# EAGLE design Version_1 (EAGLE 6.3)
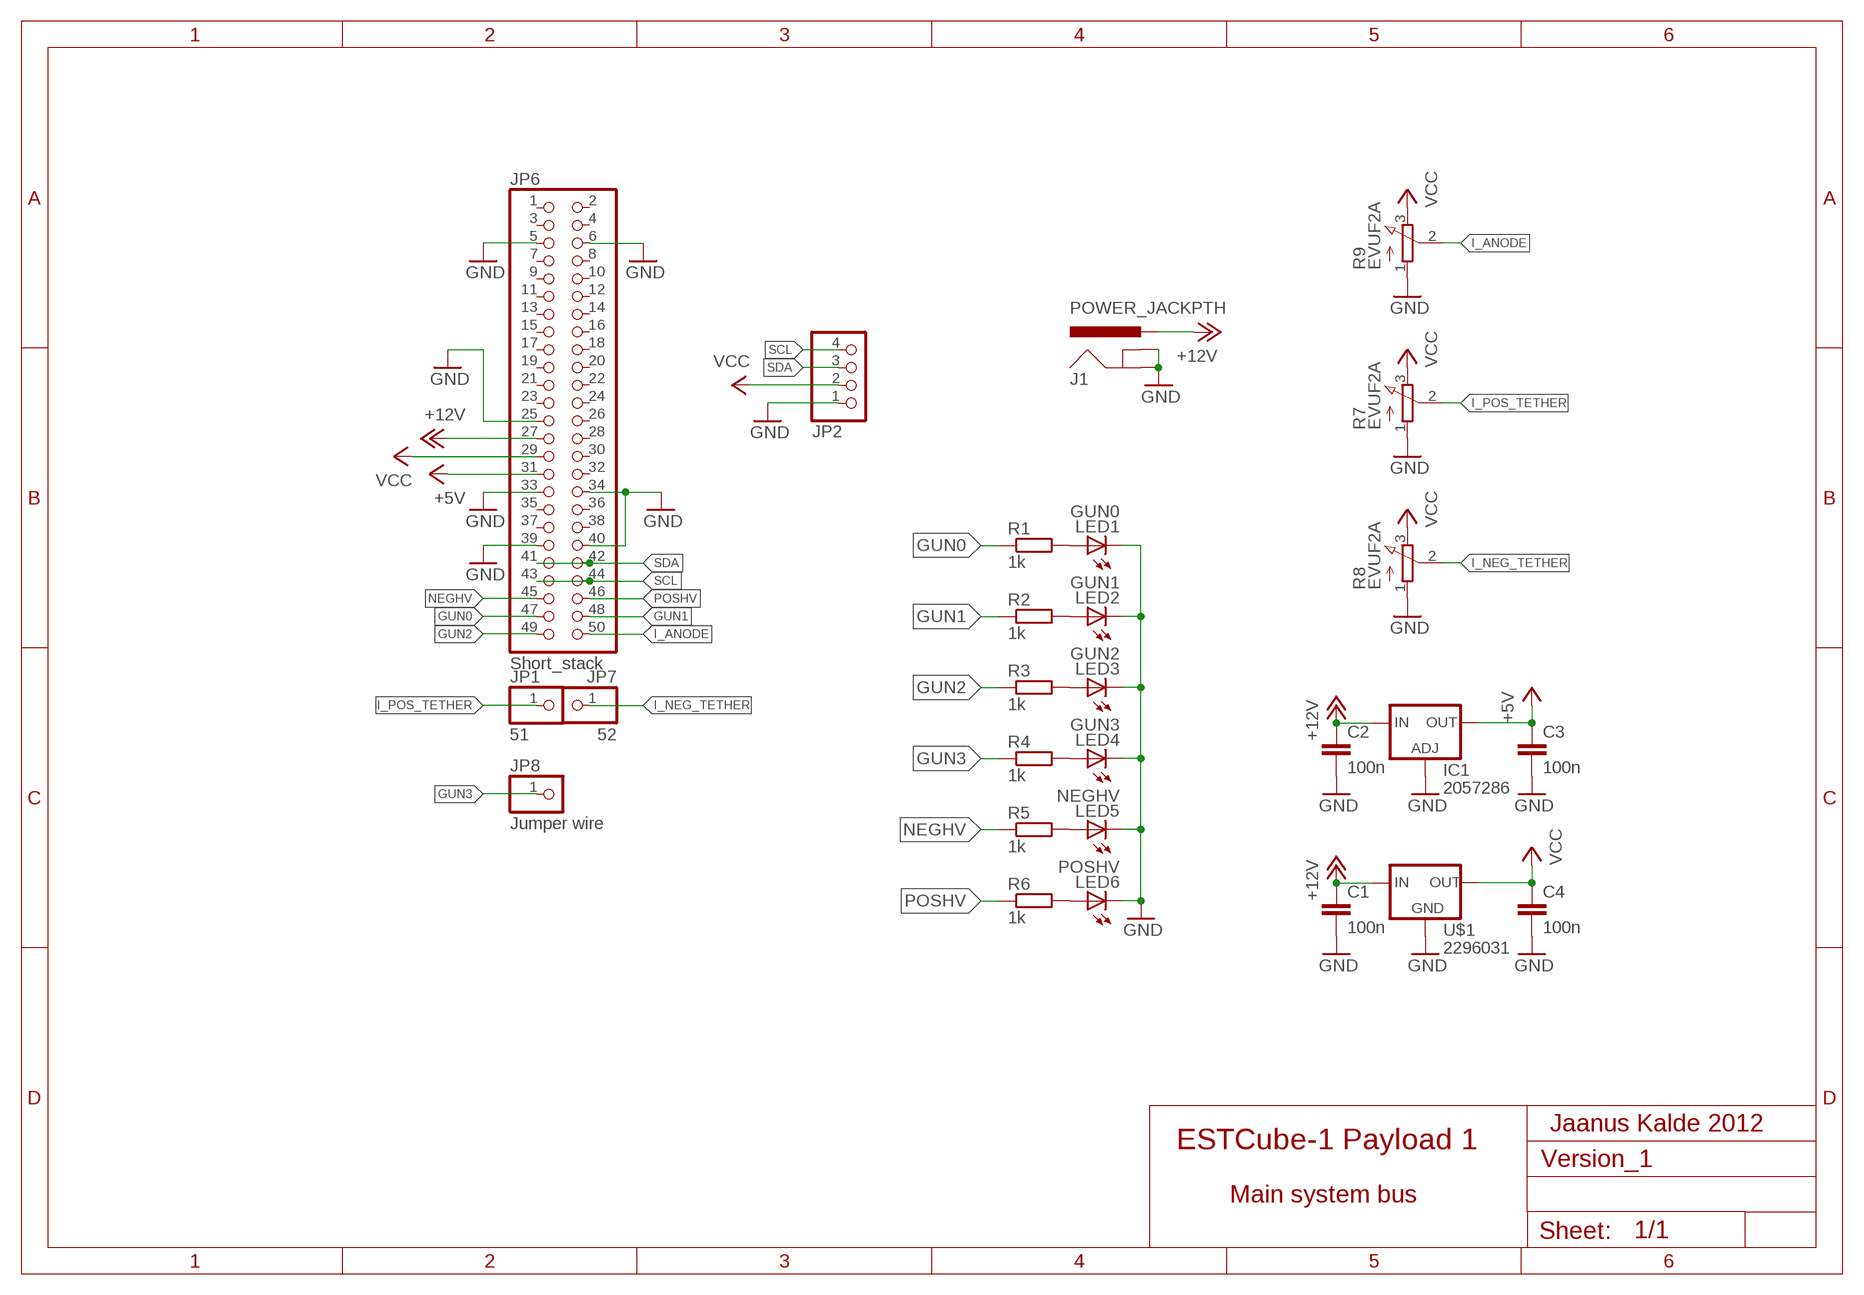
[diagram p0: schematic, sheet 1]

## Parts
C1  100n  C-EUC0603K  [C0603K]
C2  100n  C-EUC0603K  [C0603K]
C3  100n  C-EUC0603K  [C0603K]
C4  100n  C-EUC0603K  [C0603K]
IC1  2057286  LM317MBSTT3  [SOT223]
J1  POWER_JACKPTH  [POWER_JACK_PTH]
JP1  51  PINHD-1X1  [1X01]
JP2  PINHD-1X4  [1X04]
JP6  Short_stack  PINHD-2X25  [2X25]
JP7  52  PINHD-1X1  [1X01]
JP8  Jumper wire  PINHD-1X1  [1X01]
LED1  GUN0  LED0603  [LED-0603]
LED2  GUN1  LED0603  [LED-0603]
LED3  GUN2  LED0603  [LED-0603]
LED4  GUN3  LED0603  [LED-0603]
LED5  NEGHV  LED0603  [LED-0603]
LED6  POSHV  LED0603  [LED-0603]
R1  1k  R-EU_R0603  [R0603]
R2  1k  R-EU_R0603  [R0603]
R3  1k  R-EU_R0603  [R0603]
R4  1k  R-EU_R0603  [R0603]
R5  1k  R-EU_R0603  [R0603]
R6  1k  R-EU_R0603  [R0603]
R7  EVUF2A  [EVUF]
R8  EVUF2A  [EVUF]
R9  EVUF2A  [EVUF]
U$1  2296031  V_REG_MIC2920  [SOT223]

## Nets
+5V: C3.1 IC1.4(OUT) JP6.31
+12V: C1.1 C2.1 IC1.3(IN) J1.PWR JP6.27 U$1.1(IN)
GND: C1.2 C2.2 C3.2 C4.2 IC1.1(ADJ) J1.GND J1.GNDBREAK JP2.1 JP6.5 JP6.6 JP6.25 JP6.33 JP6.34 JP6.39 JP6.40 LED1.C LED2.C LED3.C LED4.C LED5.C LED6.C R7.1(A) R8.1(A) R9.1(A) U$1.2(GND)
GUN0: JP6.47 R1.1
GUN1: JP6.48 R2.1
GUN2: JP6.49 R3.1
GUN3: JP8.1 R4.1
I_ANODE: JP6.50 R9.2(S)
I_NEG_TETHER: JP7.1 R8.2(S)
I_POS_TETHER: JP1.1 R7.2(S)
N$2: LED1.A R1.2
N$3: LED2.A R2.2
N$4: LED3.A R3.2
N$5: LED4.A R4.2
N$6: LED5.A R5.2
N$7: LED6.A R6.2
NEGHV: JP6.45 R5.1
POSHV: JP6.46 R6.1
SCL: JP2.4 JP6.43 JP6.44
SDA: JP2.3 JP6.41 JP6.42
VCC: C4.1 JP2.2 JP6.29 R7.3(E) R8.3(E) R9.3(E) U$1.3(OUT)
Unconnected: JP6.1 JP6.2 JP6.3 JP6.4 JP6.7 JP6.8 JP6.9 JP6.10 JP6.11 JP6.12 JP6.13 JP6.14 JP6.15 JP6.16 JP6.17 JP6.18 JP6.19 JP6.20 JP6.21 JP6.22 JP6.23 JP6.24 JP6.26 JP6.28 JP6.30 JP6.32 JP6.35 JP6.36 JP6.37 JP6.38

## Notes on the sheet
- Jaanus Kalde 2012
- ESTCube-1 Payload 1
- Main system bus

## Library data of the parts
C1-C4 = rcl:C-EU: CAPACITOR, European symbol
IC1 = v-reg:LM317?*: 500 mA Adjustable Output Positive Voltage Regulator Source: http://www.onsemi.co.jp .. LM317M-D.PDF
J1 = SparkFun:POWER_JACK: Power Jack This is the standard 5.5mm barrel jack for power. The PTH is the most common, proven, reliable, footprint. All others are experimental. The Slot footprint only works if the mill layer is transmitted to the PCB fab house so be warned. Spark Fun Electronics SKU : PRT-00119. Mating wall wart : TOL-00298 (and others)
JP1 JP7 JP8 = pinhead:PINHD-1X1: PIN HEADER
JP2 = pinhead:PINHD-1X4: PIN HEADER
JP6 = pinhead:PINHD-2X25: PIN HEADER
LED1-LED6 = SparkFun:LED: LEDs Standard schematic elements and footprints for 5mm, 3mm, 1206, and 0603 sized LEDs. 5mm - Spark Fun Electronics SKU : COM-00529 (and others)
R1-R6 = rcl:R-EU_: RESISTOR, European symbol
R7-R9 = pot:EVU: 9 mm Square Rotary Potentiometers Source: Panasonic
U$1 = SparkFun:V_REG_MIC2920: MIC2920A (http://www.micrel.com/_PDF/mic2920.pdf) - 400mA output LDO Regulator

## Board
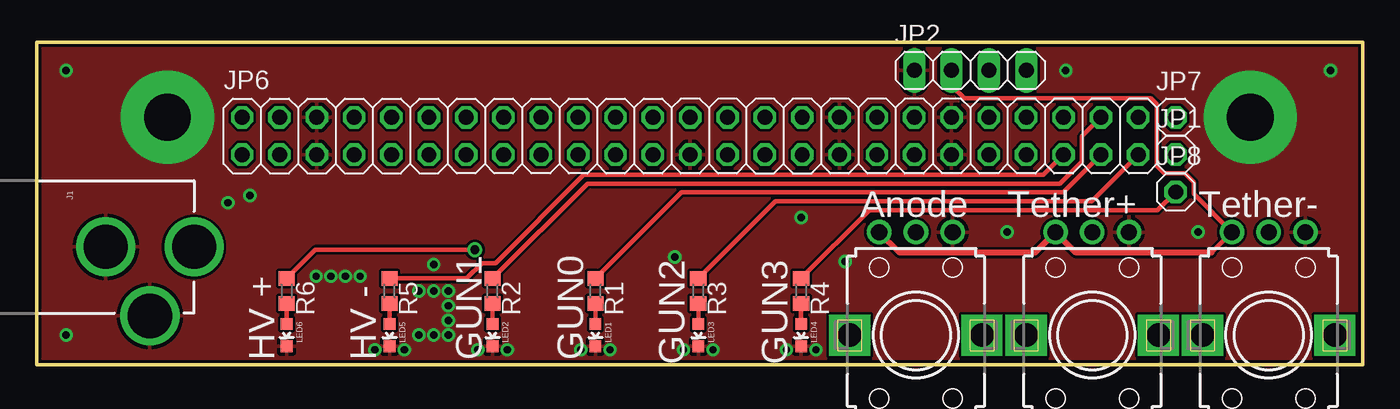
[diagram p1: board, top side]
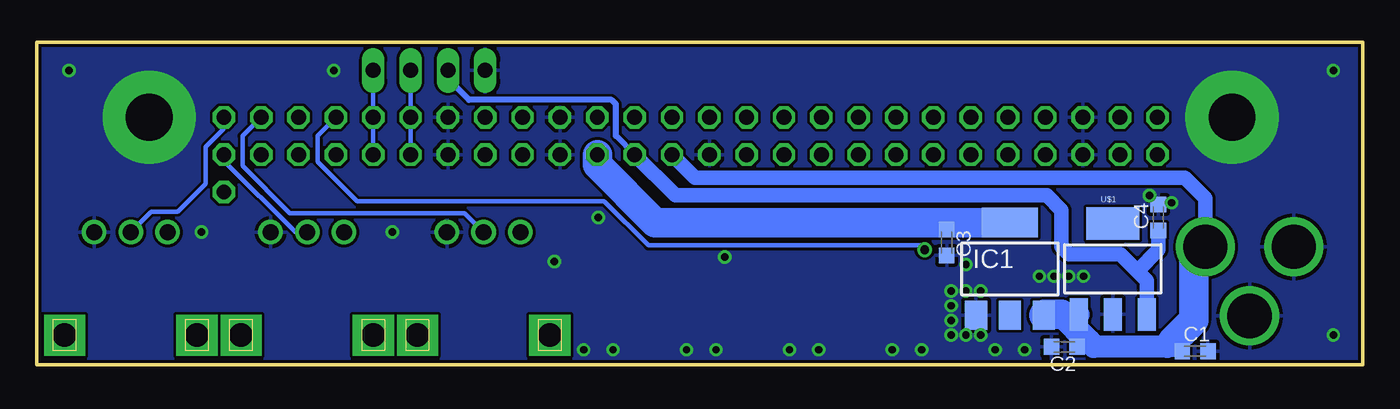
[diagram p2: board, bottom side, seen from below]

Size 90.2 x 21.9 mm. Coordinates in mm from the lower left corner, seen from the top.
Outline: 0,0 90.2,0 90.2,21.9 0,21.9 0,0
Copper layers (1*16): Top 0.035mm / dielectric 0.3mm / Bottom 0.035mm
Design rules "brandner_6layers *": minimum track width 0.05mm, minimum drill 0.1mm, track to track 0.19mm, track to pad 0.19mm, pad to pad 0.19mm, via to via 0.19mm, smd to smd 0mil, copper to edge 0.2mm, drill to drill 0.15mm, minimum pad ring 10mil, minimum via ring 8mil, stop-mask expansion 0.05mm, vias tented up to drill 0.8mm, thermal gap 10mil
bKeepout: area 35.2,22.5 to 39.2,26.5; area 39.7,64.5 to 43.7,68.5; area 81.7,64.5 to 85.7,68.5
bRestrict: area 35.2,22.5 to 39.2,26.5; area 35.2,48.5 to 39.2,52.5; area 50.7,41.5 to 54.7,45.5; area 70.7,30.5 to 74.7,34.5; area 86.2,22.5 to 90.2,26.5; area 86.2,48.5 to 90.2,52.5; area 81.7,64.5 to 85.7,68.5; area 39.7,64.5 to 43.7,68.5

### Footprints (pad centres in the part's own frame; a part is rotated, then mirrored left to right if it is on the bottom)
C0603K = smd 1.05 x 1.08: 1 -0.875,0; 2 0.875,0
SOT223 = smd 1.5 x 2: 1 -2.3,-3.15; 2 0,-3.15; 3 2.3,-3.15 | smd 3.8 x 2: 4 0,3.15
POWER_JACK_PTH = drill 2.997: GND 0,7.7; GNDBREAK 4.7,10.7; PWR 0,13.7
1X01 = drill 1.016 octagon: 1 0,0
1X04 = drill 1.016 long: 1 -3.81,0; 2 -1.27,0; 3 1.27,0; 4 3.81,0
2X25 = drill 1.016 octagon: 1 -30.48,-1.27; 2 -30.48,1.27; 3 -27.94,-1.27; 4 -27.94,1.27; 5 -25.4,-1.27; 6 -25.4,1.27; 7 -22.86,-1.27; 8 -22.86,1.27; 9 -20.32,-1.27; 10 -20.32,1.27; 11 -17.78,-1.27; 12 -17.78,1.27; 13 -15.24,-1.27; 14 -15.24,1.27; 15 -12.7,-1.27; 16 -12.7,1.27; 17 -10.16,-1.27; 18 -10.16,1.27; 19 -7.62,-1.27; 20 -7.62,1.27; 21 -5.08,-1.27; 22 -5.08,1.27; 23 -2.54,-1.27; 24 -2.54,1.27; 25 0,-1.27; 26 0,1.27; 27 2.54,-1.27; 28 2.54,1.27; 29 5.08,-1.27; 30 5.08,1.27; 31 7.62,-1.27; 32 7.62,1.27; 33 10.16,-1.27; 34 10.16,1.27; 35 12.7,-1.27; 36 12.7,1.27; 37 15.24,-1.27; 38 15.24,1.27; 39 17.78,-1.27; 40 17.78,1.27; 41 20.32,-1.27; 42 20.32,1.27; 43 22.86,-1.27; 44 22.86,1.27; 45 25.4,-1.27; 46 25.4,1.27; 47 27.94,-1.27; 48 27.94,1.27; 49 30.48,-1.27; 50 30.48,1.27
LED-0603 = smd 0.8 x 0.8: A 0,-0.75; C 0,0.75
R0603 = smd 1 x 1.1: 1 -0.85,0; 2 0.85,0
EVUF = drill 1.1 pad 1.676: 1 -2.5,-7; 2 0,-7; 3 2.5,-7 | drill 1.6 pad 2.8 square: M1 4.5,0; M2 -4.5,0
SOT223' = smd 1.219 x 2.235: 1 -2.311,-3.099; 2 0,-3.099; 3 2.311,-3.099 | smd 3.6 x 2.2: 4 0,3.099

### Placement (x,y rotation side)
C1  11.4,0.9 0 bottom
C2  20.3,1.2 180 bottom
C3  28.3,8.3 270 bottom
C4  13.9,10 90 bottom
IC1  24,6.5 0 bottom
J1  -3,8 270 top
JP1  77.47,14.27 0 top
JP2  63.5,20 0 top
JP6  44.45,15.54 0 top
JP7  77.47,16.81 0 top
JP8  77.47,11.73 0 top
LED1  38,2 180 top
LED2  31,2 180 top
LED3  45,2 180 top
LED4  52,2 180 top
LED5  24,2 180 top
LED6  17,2 180 top
R1  38,5 270 top
R2  31,5 270 top
R3  45,5 270 top
R4  52,5 270 top
R5  24,5 270 top
R6  17,5 270 top
R7  71.8,2 180 top
R8  83.8,2 180 top
R9  59.8,2 180 top
U$1  2296031  [SOT223']  17,6.5 0 bottom

### Tracks (layer width: path | path; a pad name or v marks a point on that pad's centre or on a via)
+5V
  Bottom 1: C3.1 28.3,9.65
  Bottom 2: IC1.4 28.3,9.65 48.15,9.65 52.07,13.57 JP6.31
+12V
  Bottom 1: JP6.27 45.42,12.7 12.1,12.7 10.7,11.3 J1.PWR | C2.1 19,1.2 18.65,1.55 | C1.1 12.4,0.9 13,1.5
  Bottom 1.5: 20.5,3.4 U$1.1 | 13,1.5 13.3,1.2 18.3,1.2 18.65,1.55
  Bottom 1.7: 18.65,1.55 20.5,3.4
  Bottom 2: IC1.3 21.65,3.4 20.5,3.4 | J1.PWR 11.5,7.2 11.5,3 13,1.5
GND  (via drill 0.5, 3.18 pad 6.35)
  other vias: 22,6 21,6 28,2 19,6 20,6 2,2 28,5 2,20 70,20 51,1 46,1 25,1 79,9 88,20 53,1 26,5 27,5 27,2 23,1 28,4 28,3 27,6.8 26,2 32,1 14.5,11.5 13,11 43.4,7.3 44,1 8.89,16.81 82.55,16.81 52,10 30,1 37,1 39,1 55,7 66,9
  pour Top (rank 4): 90,22 0,22 0,0 90,0
  pour Bottom (rank 4): 90,22 90,0 0,0 0,22
GUN0
  Top 0.3: JP6.47 69.82,11.7 43.85,11.7 R1.1
GUN1
  Top 0.3: JP6.48 71.1,15.52 71.1,13.8 69.6,12.3 37.45,12.3 R2.1
GUN2
  Top 0.3: JP6.49 71.76,11.1 50.25,11.1 R3.1
GUN3
  Top 0.3: JP8.1 76.24,10.5 56.65,10.5 R4.1
I_ANODE
  Bottom 0.3: JP6.50 76.2,15.54 76.2,13.5 73,10.3 61.1,10.3 R9.2
I_NEG_TETHER
  Bottom 0.3: JP7.1 77.47,16.03 78.7,14.8 78.7,12.3 80.6,10.4 82.4,10.4 R8.2
I_POS_TETHER
  Bottom 0.3: JP1.1 77.47,13.87 72.6,9 R7.2
N$2
  Top 0.3: R1.2 LED1.A
N$3
  Top 0.3: R2.2 LED2.A
N$4
  Top 0.3: LED3.A R3.2
N$5
  Top 0.3: LED4.A R4.2
N$6
  Top 0.3: R5.2 LED5.A
N$7
  Top 0.3: R6.2 LED6.A
NEGHV
  Top 0.3: JP6.45 68.48,12.9 37.2,12.9 31.2,6.9 30.3,6.9 29.25,5.85 R5.1
POSHV  (via drill 0.6)
  Top 0.3: v29.8,7.8 18.95,7.8 R6.1
  Bottom 0.3: JP6.46 71.1,15.56 71.1,13.8 68.4,11.1 51.6,11.1 48.6,8.1 30.1,8.1 v29.8,7.8
SCL
  Bottom 0.3: JP6.43 JP6.44 JP2.4
SDA
  Bottom 0.3: JP2.3 JP6.42 JP6.41
VCC
  Top 0.3: JP2.2 62.23,18.97 63.1,18.1 75.8,18.1 76.2,17.7 76.2,13.5 76.7,13 78.1,13 78.7,12.4 78.7,11.6 R8.3 79.9,7.6
  Top 0.4: 79.9,7.6 70.7,7.6 R7.3 67.9,7.6 58.7,7.6 R9.3
  Bottom 0.4: JP6.29 50.8,15.54 50.8,17.7 51.1,18 60.8,18 62.23,19.43 JP2.2
  Bottom 1: JP6.29 46.76,11.5 21.5,11.5 20.5,10.5 20.5,8 20,7.5 16.5,7.5 15.35,6.35 | 15.35,6.35 14.69,5.69 U$1.3 | C4.1 13.9,7.8 15.35,6.35

### Text on the board
tStop: Jaanus 2013
bStop: +40V
_tsilk: Anode | Tether+ | Tether- | HV + | HV - | GUN1 | GUN0 | GUN2 | GUN3